# EAGLE design XbeeFeatherWing (EAGLE 7.5.0)
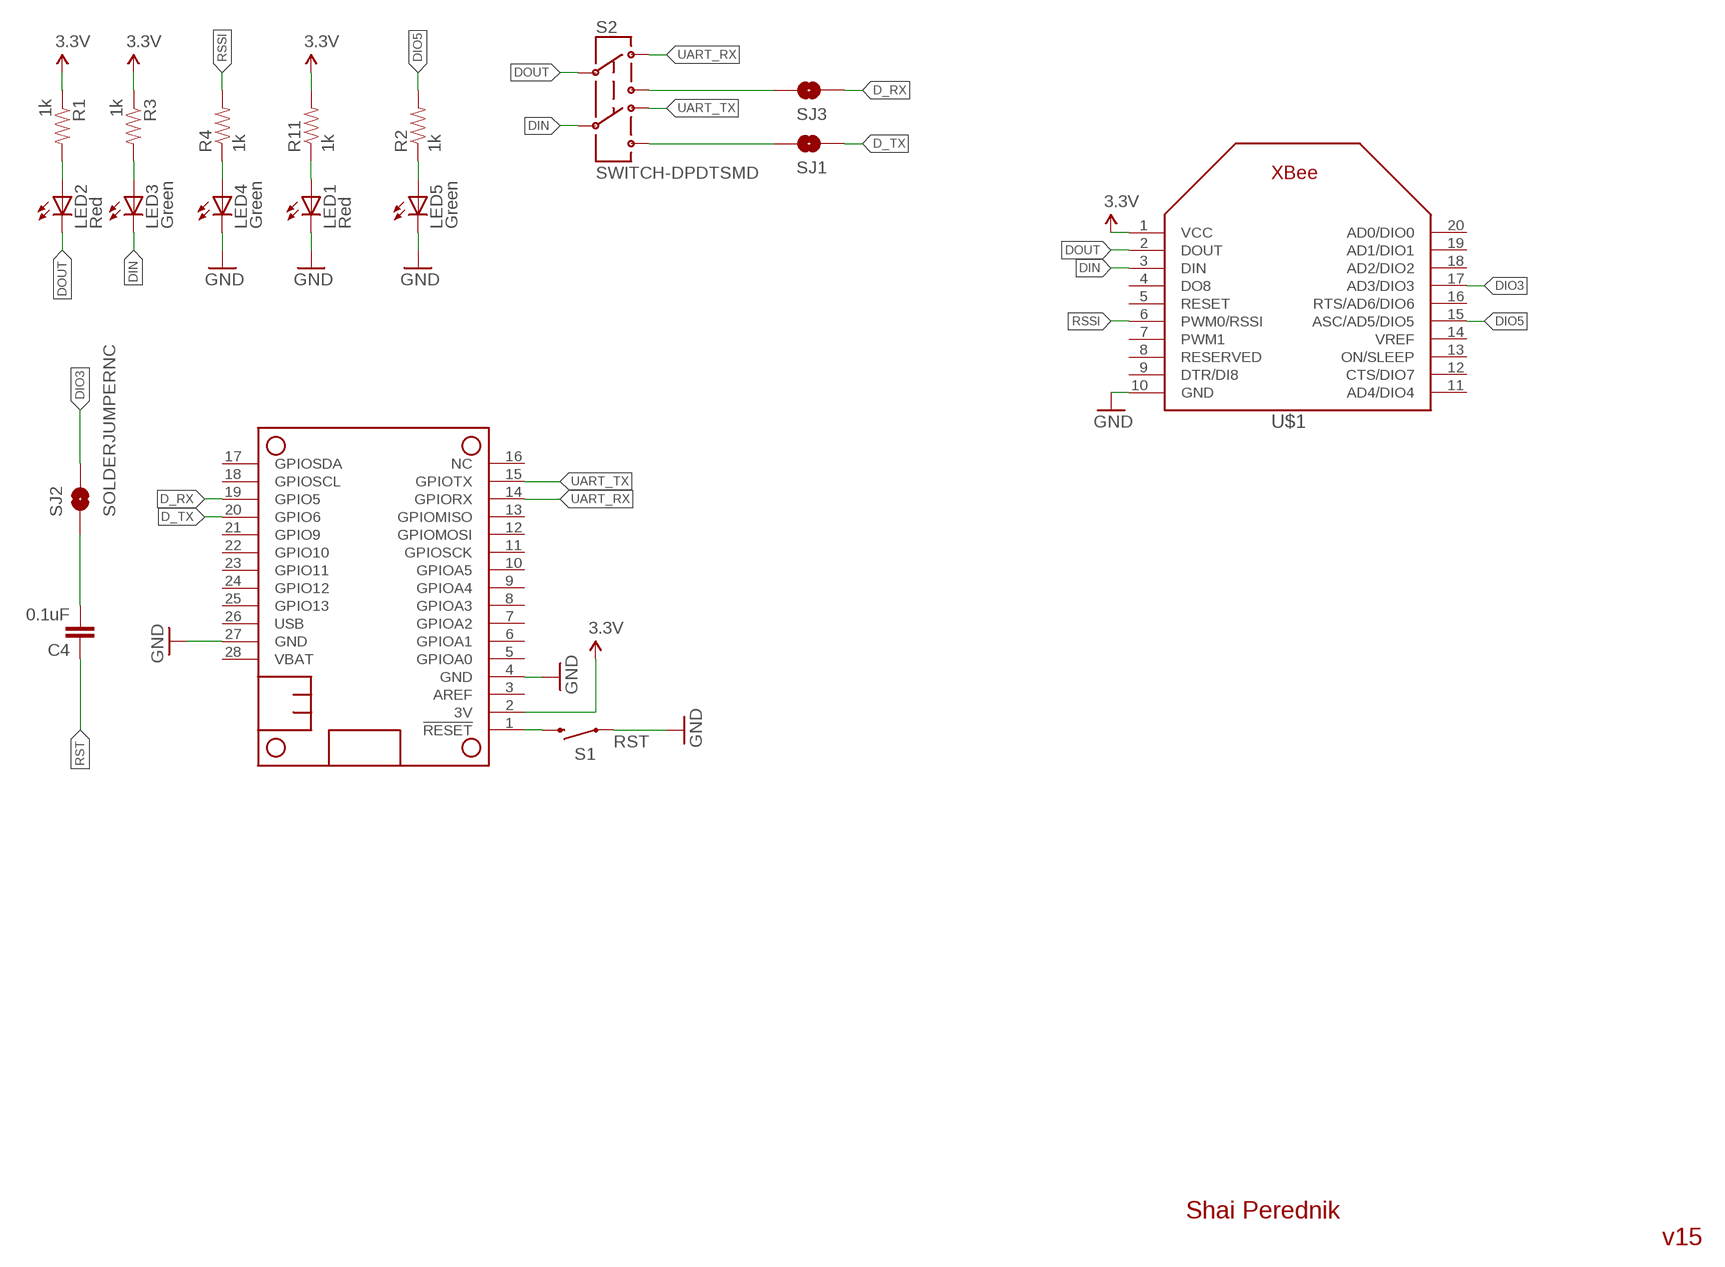
[diagram p0: schematic, sheet 1]

## Parts
C4  0.1uF  0.1UF-25V(+80/-20%)(0603)  [0603-CAP]
LED1  Red  LED-RED0603  [LED-0603]
LED2  Red  LED-RED0603  [LED-0603]
LED3  Green  LED-GREEN0603  [LED-0603]
LED4  Green  LED-GREEN0603  [LED-0603]
LED5  Green  LED-GREEN0603  [LED-0603]
MS2  MICROSHIELD_NODIM  [MICROSHIELD_DIM]
R1  1k  1KOHM1/10W1%(0603)  [0603-RES]
R2  1k  1KOHM1/10W1%(0603)  [0603-RES]
R3  1k  1KOHM1/10W1%(0603)  [0603-RES]
R4  1k  1KOHM1/10W1%(0603)  [0603-RES]
R11  1k  1KOHM1/10W1%(0603)  [0603-RES]
S1  SWITCH-MOMENTARY-2SMD  [TACTILE_SWITCH_SMD]
S2  SWITCH-DPDTSMD  [AYZ0202]
SJ1  D_TX  SOLDERJUMPERNC  [SJ_2S]
SJ2  SOLDERJUMPERNC  [SJ_2S]
SJ3  D_RX  SOLDERJUMPERNC  [SJ_2S]
U$1  XBEE  [XBEE]

## Nets
3.3V: MS2.2(3V) R1.1 R3.1 R11.2 U$1.1(VCC)
D_RX: MS2.19(GPIO5) SJ3.1
D_TX: MS2.20(GPIO6) SJ1.1
DIN: LED3.C S2.5 U$1.3(DIN)
DIO3: SJ2.2 U$1.17(AD3/DIO3)
DIO5: R2.2 U$1.15(ASC/AD5/DIO5)
DOUT: LED2.C S2.2 U$1.2(DOUT)
GND: LED1.C LED4.C LED5.C MS2.4(GND) MS2.27(GND) S1.1 U$1.10(GND)
N$1: LED2.A R1.2
N$2: LED4.A R4.1
N$4: LED3.A R3.2
N$5: C4.2 SJ2.1
N$38: LED1.A R11.1
N$139: LED5.A R2.1
N$140: S2.6 SJ1.2
N$141: S2.3 SJ3.2
RSSI: R4.2 U$1.6(PWM0/RSSI)
RST: C4.1 MS2.1(!RESET) S1.3
UART_RX: MS2.14(GPIORX) S2.1
UART_TX: MS2.15(GPIOTX) S2.4
Unconnected: MS2.3(AREF) MS2.5(GPIOA0) MS2.6(GPIOA1) MS2.7(GPIOA2) MS2.8(GPIOA3) MS2.9(GPIOA4) MS2.10(GPIOA5) MS2.11(GPIOSCK) MS2.12(GPIOMOSI) MS2.13(GPIOMISO) MS2.16(NC) MS2.17(GPIOSDA) MS2.18(GPIOSCL) MS2.21(GPIO9) MS2.22(GPIO10) MS2.23(GPIO11) MS2.24(GPIO12) MS2.25(GPIO13) MS2.26(USB) MS2.28(VBAT) U$1.4(DO8) U$1.5(RESET) U$1.7(PWM1) U$1.8(RESERVED) U$1.9(DTR/DI8) U$1.11(AD4/DIO4) U$1.12(CTS/DIO7) U$1.13(ON/SLEEP) U$1.14(VREF) U$1.16(RTS/AD6/DIO6) U$1.18(AD2/DIO2) U$1.19(AD1/DIO1) U$1.20(AD0/DIO0)

## Notes on the sheet
- Shai Perednik
- v15

## Library data of the parts
C4 = SparkFun-Capacitors:0.1UF-25V(+80/-20%)(0603): CAP-00810 Ceramic Standard decoupling cap; PROD_ID: CAP-00810
LED1 LED2 = SparkFun-LED:LED-RED: Assorted Red LEDs LilyPad 1206- DIO-09912 1206- DIO-00809 0603- DIO-00819; PROD_ID: DIO-00819; VALUE: RED
LED3-LED5 = SparkFun-LED:LED-GREEN: Various green LEDs Green LEDs used in SFE Production 0603- DIO-00821 LARGE- DIO-00862 LILYPAD- DIO-09910; PROD_ID: DIO-00821; VALUE: GREEN
MS2 = Proto FeatherWing:MICROSHIELD
R1-R4 R11 = SparkFun-Resistors:1KOHM1/10W1%(0603): RES-07856; PROD_ID: RES-07856; VALUE: 1K
S1 = SparkFun:SWITCH-MOMENTARY-2
S2 = SparkFun:SWITCH-DPDT: DPDT Version of the COM-00597
SJ1 SJ3 = SparkFun:SOLDERJUMPER: Solder Jumper Standard SMD solder jumper. Used to automate production. Two varients : Normally Open and Normally Closed are the same, but have different paste layers. NC will have a large amount of paste and should jumper during reflow.
SJ2 = SparkFun-Retired:SOLDERJUMPER: Solder Jumper Standard SMD solder jumper. Used to automate production. Two varients : Normally Open and Normally Closed are the same, but have different paste layers. NC will have a large amount of paste and should jumper during reflow.
U$1 = adafruit:XBEE

## Net classes
0 default: width 0.203 mm
1 vcc: width 0.305 mm

## Board
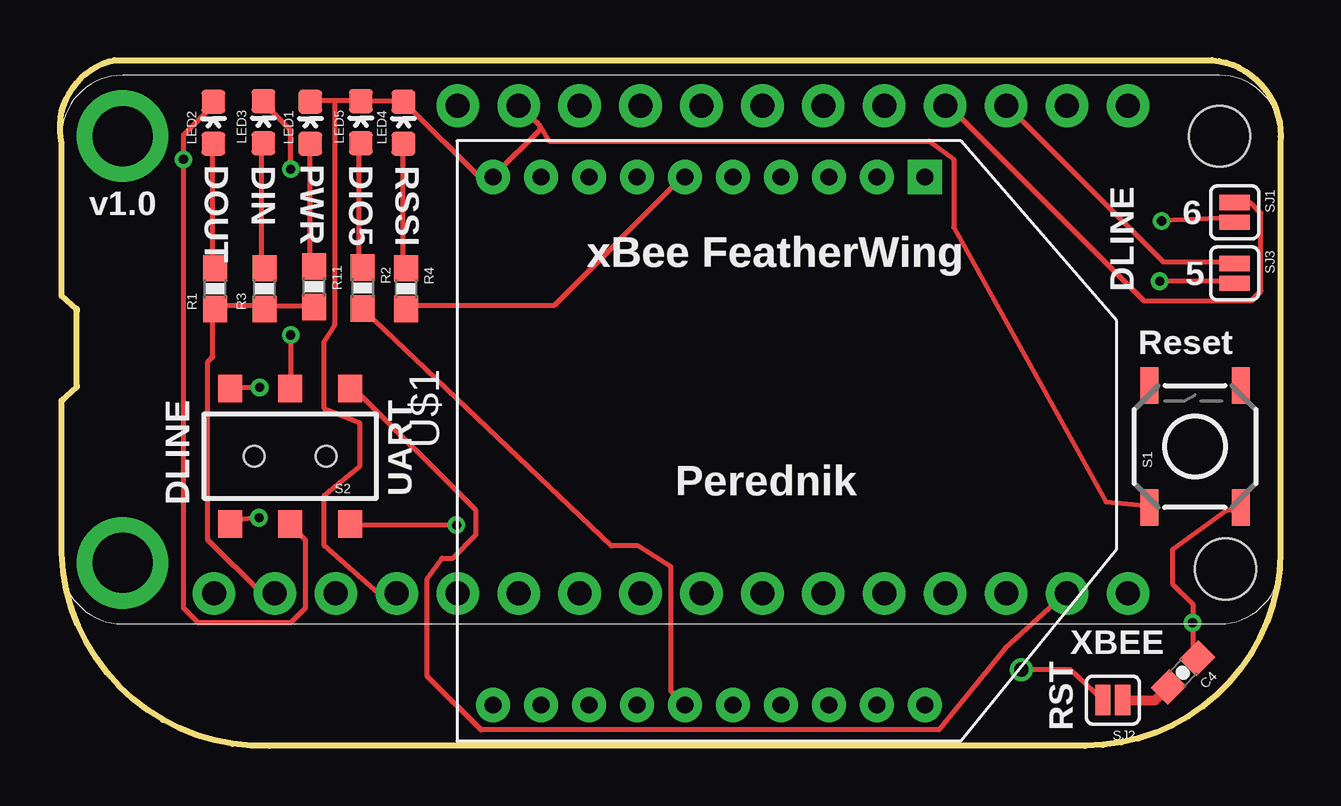
[diagram p1: board, top side]
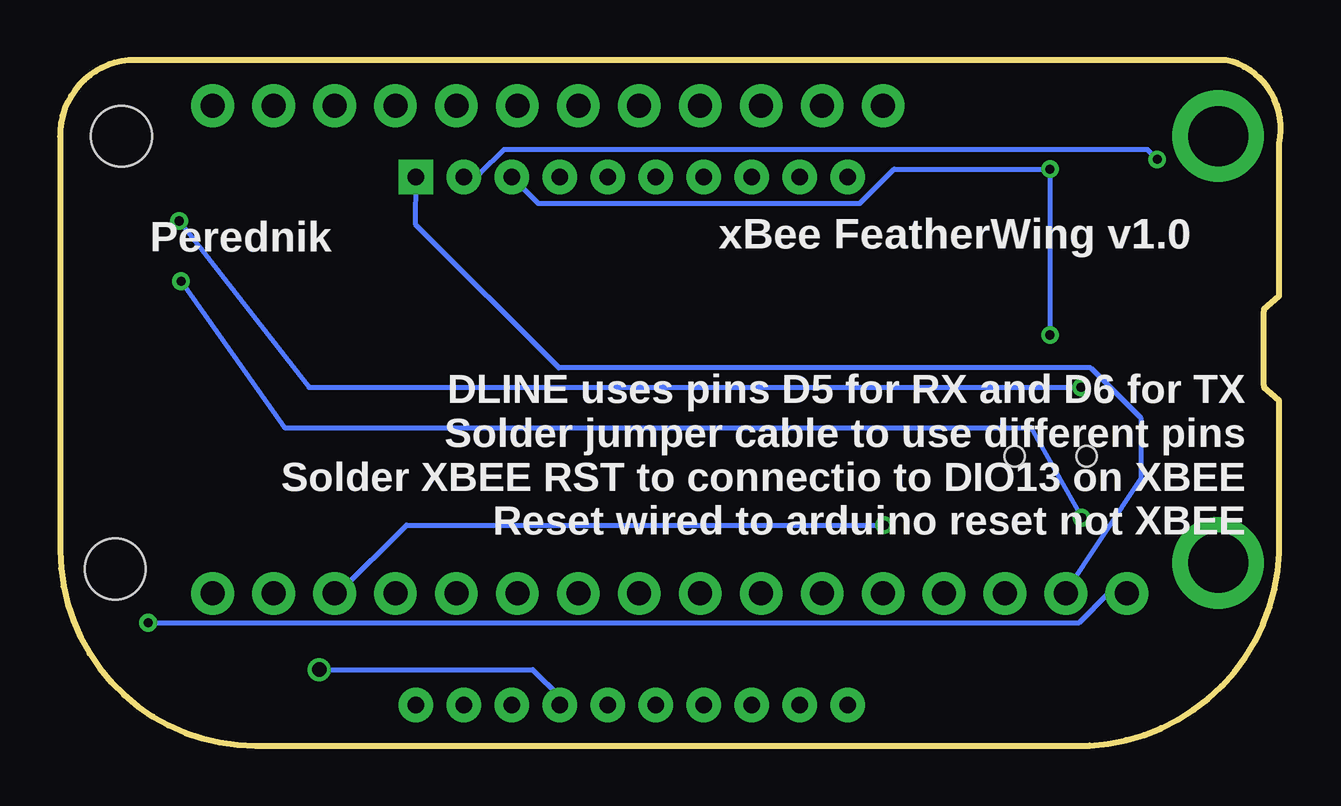
[diagram p2: board, bottom side, seen from below]

Size 50.88 x 28.57 mm. Coordinates in mm from the lower left corner, seen from the top.
Outline: 0.07,18.83 0.07,25.1 arc-90 2.27,28.57 48.03,28.57 arc-90 50.87,25.1 50.87,8.13 arc-90 42.74,0 8.74,0 arc-90 0.07,8.03 0.07,14.3
Outline: 0.7,18.19 0.07,18.75
Outline: 0.7,15.02 0.7,18.12
Outline: 0.07,14.38 0.7,14.94
Copper layers (1*16): Top 0.0356mm / dielectric 1.5011mm / Bottom 0.0356mm
Design rules "OshPark-LaenPCBOrder": minimum track width 6mil, minimum drill 13mil, track to track 6mil, track to pad 6mil, pad to pad 6mil, via to via 6mil, smd to smd 6mil, copper to edge 15mil, drill to drill 6mil, minimum pad ring 7mil, minimum via ring 7mil, stop-mask expansion 3mil, vias tented up to drill 0mil, thermal gap 10mil

### Footprints (pad centres in the part's own frame; a part is rotated, then mirrored left to right if it is on the bottom)
0603-CAP = smd 1.1 x 1: 1 -0.85,0; 2 0.85,0
LED-0603 = smd 1 x 1: A 0,-0.877; C 0,0.877
MICROSHIELD_DIM = drill 1 pad 1.778: 1 6.35,1.27; 2 8.89,1.27; 3 11.43,1.27; 4 13.97,1.27; 5 16.51,1.27; 6 19.05,1.27; 7 21.59,1.27; 8 24.13,1.27; 9 26.67,1.27; 10 29.21,1.27; 11 31.75,1.27; 12 34.29,1.27; 13 36.83,1.27; 14 39.37,1.27; 15 41.91,1.27; 16 44.45,1.27; 17 44.45,21.59; 18 41.91,21.59; 19 39.37,21.59; 20 36.83,21.59; 21 34.29,21.59; 22 31.75,21.59; 23 29.21,21.59; 24 26.67,21.59; 25 24.13,21.59; 26 21.59,21.59; 27 19.05,21.59; 28 16.51,21.59 | drill 2.5 pad 3.81: P$1 2.54,20.32; P$2 2.54,2.54 | hole 2.54: 48.26,20.32; 48.514,2.286
0603-RES = smd 1.1 x 1: 1 -0.85,0; 2 0.85,0
TACTILE_SWITCH_SMD = smd 1.524 x 0.762: 1 -2.54,1.905; 2 2.54,1.905; 3 -2.54,-1.905; 4 2.54,-1.905
AYZ0202 = smd 1 x 1.15: 1 -2.5,2.825; 2 0,2.825; 3 2.5,2.825; 4 -2.5,-2.825; 5 0,-2.825; 6 2.5,-2.825 | hole 0.85: 1.5,0; -1.5,0
SJ_2S = smd 0.635 x 1.27: 1 -0.412,0; 2 0.412,0
XBEE = drill 0.7 pad 1.422 square: 1 -11,5.5 | drill 0.7 pad 1.422: 2 -11,3.5; 3 -11,1.5; 4 -11,-0.5; 5 -11,-2.5; 6 -11,-4.5; 7 -11,-6.5; 8 -11,-8.5; 9 -11,-10.5; 10 -11,-12.5; 11 11,-12.5; 12 11,-10.5; 13 11,-8.5; 14 11,-6.5; 15 11,-4.5; 16 11,-2.5; 17 11,-0.5; 18 11,1.5; 19 11,3.5; 20 11,5.5

### Placement (x,y rotation side)
C4  46.8,3.05 225 top
LED1  10.43,25.96 0 top
LED2  6.39,25.96 0 top
LED3  8.48,25.98 0 top
LED4  14.32,25.96 0 top
LED5  12.54,25.98 0 top
MS2  0.07,5.08 0 top
R1  6.47,19.05 90 top
R2  12.62,19.08 270 top
R3  8.53,19.05 90 top
R4  14.42,19.05 270 top
R11  10.58,19.13 270 top
S1  47.31,12.47 90 top
S2  9.59,12.06 180 top
SJ1  48.96,22.23 270 top
SJ2  43.88,1.9 180 top
SJ3  48.96,19.69 270 top
U$1  30.55,12.7 270 top

### Tracks (layer width: path | path; a pad name or v marks a point on that pad's centre or on a via)
3.3V
  Top 0.203: R11.2 10.43,18.34 8.6,18.34 R3.1 8.4,18.34 6.57,18.34 R1.1 6.37,18.14 6.37,16.21 6.16,16 6.16,8.58 8.4,6.35 MS2.2
  Bottom 0.203: U$1.1 36.03,23.62 36.06,21.72 30.09,15.75 7.92,15.75 5.83,13.67 5.83,11.12 9.01,6.35 MS2.2
D_RX
  Top 0.203: SJ3.1 48.84,20.17 45.99,20.17 39.49,26.67 MS2.19
D_TX
  Top 0.203: SJ1.1 49.04,22.61 49.65,22.61 50.06,22.2 50.06,18.95 49.65,18.54 45.18,18.54 37.05,26.67 MS2.20
DIN  (via drill 0.38)
  Top 0.203: v9.62,24.03 9.62,25.65 8.6,26.67 LED3.C | v9.62,17.12 9.62,15.09 S2.5
  Bottom 0.203: U$1.3 31.97,23.62 30.95,22.61 17.54,22.61 16.12,24.03 v9.62,24.03 v9.62,17.12
DIO3  (via drill 0.6)
  Top 0.203: SJ2.2 42.11,3.18 v40.07,3.18
  Bottom 0.203: v40.07,3.18 31.18,3.18 30.05,2.04 U$1.17
DIO5
  Top 0.203: R2.2 12.67,18.14 22.98,8.33 24.1,8.33 25.47,7.47 25.47,2.29 25.87,1.88 U$1.15
DOUT  (via drill 0.38)
  Top 0.203: LED2.C 6.37,26.67 5.15,25.45 v5.15,24.44 5.15,5.74 5.76,5.13 9.62,5.13 10.23,5.74 10.23,8.58 9.62,9.2 S2.2
  Bottom 0.203: v5.15,24.44 5.55,24.84 32.38,24.84 33.39,23.83 34,23.83 U$1.2
GND
  Top 0.203: 11.45,26.87 12.46,26.87 LED5.C 12.67,26.87 14.29,26.87 LED4.C 14.5,26.67 17.47,23.7 U$1.10 18.15,23.83 19.98,25.65 19.98,25.86 | 11.45,26.87 10.43,26.87 LED1.C | MS2.4 13.28,6.35 10.99,8.38 10.99,10.39 12.49,11.63 12.49,13.46 10.99,14.07 10.99,16.82 11.45,17.53 11.45,26.87 | 19.98,25.86 19.17,26.67 MS2.27 | 19.98,25.86 20.39,25.2 36.24,25.2 37.25,24.44 37.25,21.59 43.6,10.16 45.38,10.01 S1.1
N$1
  Top 0.203: LED2.A 6.37,25.04 6.37,19.96 R1.2
N$2
  Top 0.203: LED4.A 14.29,25.04 14.29,19.96 R4.1
N$4
  Top 0.203: LED3.A 8.4,25.04 8.4,19.96 R3.2
N$5
  Top 0.406: SJ2.1 45.66,1.9 C4.2
N$38
  Top 0.203: LED1.A 10.43,20.17 R11.1
N$139
  Top 0.203: LED5.A 12.46,25.04 12.46,19.96 R2.1
N$140  (via drill 0.38)
  Top 0.203: v45.92,21.87 48.84,22 SJ1.2 | 7.18,14.88 S2.6 | 7.23,14.94 v8.32,14.94
  Top 0.406: 7.18,14.88 7.23,14.94
  Bottom 0.203: v8.32,14.94 40.51,14.94 v45.92,21.87
N$141  (via drill 0.38)
  Top 0.203: v8.3,9.5 7.18,9.4 S2.3 | v45.84,19.36 48.84,19.36 SJ3.2
  Bottom 0.203: v8.3,9.5 10.41,13.26 41.52,13.26 v45.84,19.36
RSSI
  Top 0.203: R4.2 14.5,18.34 20.59,18.34 25.87,23.62 U$1.6
RST  (via drill 0.38)
  Top 0.203: C4.1 47.21,3.71 v47.21,5.13 47.21,5.92 46.37,6.76 46.37,8.18 48.63,9.8 49.04,9.8 S1.3
  Bottom 0.203: MS2.1 7.18,6.35 8.4,5.13 v47.21,5.13
UART_RX  (via drill 0.38)
  Top 0.203: v16.53,9.2 12.26,9.2 S2.1
  Bottom 0.203: v16.53,9.2 36.44,9.2 39.29,6.35 MS2.14
UART_TX
  Top 0.203: S2.4 12.26,14.88 17.34,9.8 17.34,8.79 16.38,7.82 15.92,7.82 15.31,6.96 15.31,2.9 17.54,0.66 36.64,0.66 39.39,4.04 41.93,6.35 MS2.15

### Text on the board
tPlace: DOUT | DIN | PWR | DIO5 | RSSI | v1.0 | 6 | xBee FeatherWing | xBee FeatherWing | 5 | DLINE | Reset | Perednik | DLINE | UART | XBEE | RST
bPlace: Perednik | xBee FeatherWing v1.0 | DLINE uses pins D5 for RX and D6 for TX / Solder jumper cable to use different pins / Solder XBEE RST to connectio to DIO13 on XBEE / Reset wired to arduino reset not XBEE